# EAGLE design LlethrauControls (EAGLE 9.6.2)
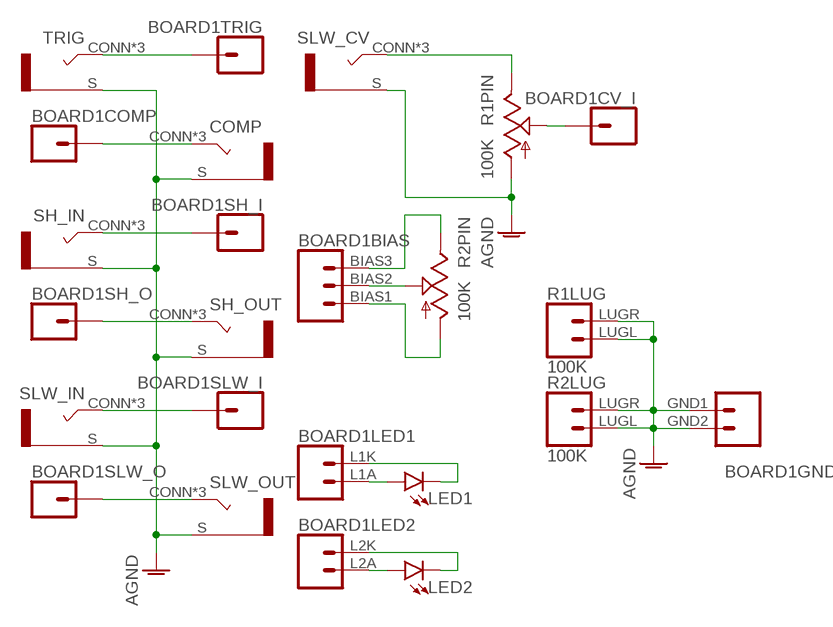
[diagram p0: schematic, sheet 1]

## Parts
BOARD1  LLETHRAU_LINK  [LLETHRAU]
COMP  COMBI-JACKCINCHNANA  [NEWCOMBOJACK_PANEL]
LED1  LED5MM  [LED5MM]
LED2  LED5MM  [LED5MM]
R1  100K  POTENTIOMETER  [ALPHA_RV09_9MMPOT]
R2  100K  POTENTIOMETER  [ALPHA_RV09_9MMPOT]
SH_IN  COMBI-JACKCINCHNANA  [NEWCOMBOJACK_PANEL]
SH_OUT  COMBI-JACKCINCHNANA  [NEWCOMBOJACK_PANEL]
SLW_CV  COMBI-JACKCINCHNANA  [NEWCOMBOJACK_PANEL]
SLW_IN  COMBI-JACKCINCHNANA  [NEWCOMBOJACK_PANEL]
SLW_OUT  COMBI-JACKCINCHNANA  [NEWCOMBOJACK_PANEL]
TRIG  COMBI-JACKCINCHNANA  [NEWCOMBOJACK_PANEL]

## Nets
AGND: BOARD1.GND1 BOARD1.GND2 COMP.S R1.C1(PIN:A) R1.LUGL R1.LUGR R2.LUGL R2.LUGR SH_IN.S SH_OUT.S SLW_CV.S SLW_IN.S SLW_OUT.S TRIG.S
N$1: BOARD1.TRIG TRIG.CONN(T) TRIG.T1(T) TRIG.T2(T)
N$2: BOARD1.COMP COMP.CONN(T) COMP.T1(T) COMP.T2(T)
N$3: BOARD1.SH_I SH_IN.CONN(T) SH_IN.T1(T) SH_IN.T2(T)
N$4: BOARD1.SH_O SH_OUT.CONN(T) SH_OUT.T1(T) SH_OUT.T2(T)
N$5: BOARD1.SLW_I SLW_IN.CONN(T) SLW_IN.T1(T) SLW_IN.T2(T)
N$6: BOARD1.SLW_O SLW_OUT.CONN(T) SLW_OUT.T1(T) SLW_OUT.T2(T)
N$7: BOARD1.BIAS1 R2.C1(PIN:A)
N$8: BOARD1.BIAS2 R2.C2(PIN:W)
N$9: BOARD1.BIAS3 R2.C3(PIN:B)
N$10: BOARD1.L2A LED2.A
N$11: R1.C3(PIN:B) SLW_CV.CONN(T) SLW_CV.T1(T) SLW_CV.T2(T)
N$12: BOARD1.CV_I R1.C2(PIN:W)
N$13: BOARD1.L2K LED2.K(C)
N$14: BOARD1.L1A LED1.A
N$15: BOARD1.L1K LED1.K(C)

## Library data of the parts
BOARD1 = ElectricNoodleBox:LLETHRAU_LINK
COMP SH_IN SH_OUT SLW_CV SLW_IN SLW_OUT TRIG = ElectricNoodleBox:COMBI-JACK
LED1 LED2 = led:LED: LED OSRAM: - CHIPLED LG R971, LG N971, LY N971, LG Q971, LY Q971, LO R971, LY R971 LH N974, LH R974 LS Q976, LO Q976, LY Q976 LO Q996 - Hyper CHIPLED LW Q18S LB Q993, LB Q99A, LB R99A - SideLED LS A670, LO A670, LY A670, LG A670, LP A670 LB A673, LV A673, LT A673, LW A673 LH A674 LY A675 LS A676, LA A676, LO A676, LY A676, LW A676 LS A679, LY A679, LG A679 - Hyper Micro SIDELED® LS Y876, LA Y876, LO Y876, LY Y876 LT Y87S - SmartLED LW L88C, LW L88S LB L89C, LB L89S, LG L890 LS L89K, LO L89K, LY L89K LS L896, LA L896, LO L896, LY L896 - TOPLED LS T670, LO T670, LY T670, LG T670, LP T670 LSG T670, LSP T670, LSY T670, LOP T670, LYG T670 LG T671, LOG T671, LSG T671 LB T673, LV T673, LT T673, LW T673 LH T674 LS T676, LA T676, LO T676, LY T676, LB T676, LH T676, LSB T676, LW T676 LB T67C, LV T67C, LT T67C, LS T67K, LO T67K, LY T67K, LW E67C LS E67B, LA E67B, LO E67B, LY E67B, LB E67C, LV E67C, LT E67C LW T67C LS T679, LY T679, LG T679 LS T770, LO T770, LY T770, LG T770, LP T770 LB T773, LV T773, LT T773, LW T773 LH T774 LS E675, LA E675, LY E675, LS T675 LS T776, LA T776, LO T776, LY T776, LB T776 LHGB T686 LT T68C, LB T68C - Hyper Mini TOPLED® LB M676 - Mini TOPLED Santana® LG M470 LS M47K, LO M47K, LY M47K Source: http://www.osram.convergy.de LUXEON: - LUMILED® LXK2-PW12-R00, LXK2-PW12-S00, LXK2-PW14-U00, LXK2-PW14-V00 LXK2-PM12-R00, LXK2-PM12-S00, LXK2-PM14-U00 LXK2-PE12-Q00, LXK2-PE12-R00, LXK2-PE12-S00, LXK2-PE14-T00, LXK2-PE14-U00 LXK2-PB12-K00, LXK2-PB12-L00, LXK2-PB12-M00, LXK2-PB14-N00, LXK2-PB14-P00, LXK2-PB14-Q00 LXK2-PR12-L00, LXK2-PR12-M00, LXK2-PR14-Q00, LXK2-PR14-R00 LXK2-PD12-Q00, LXK2-PD12-R00, LXK2-PD12-S00 LXK2-PH12-R00, LXK2-PH12-S00 LXK2-PL12-P00, LXK2-PL12-Q00, LXK2-PL12-R00 Source: www.luxeon.com KINGBRIGHT: KA-3528ASYC Source: www.kingbright.com
R1 R2 = ElectricNoodleBox:POTENTIOMETER

## Board
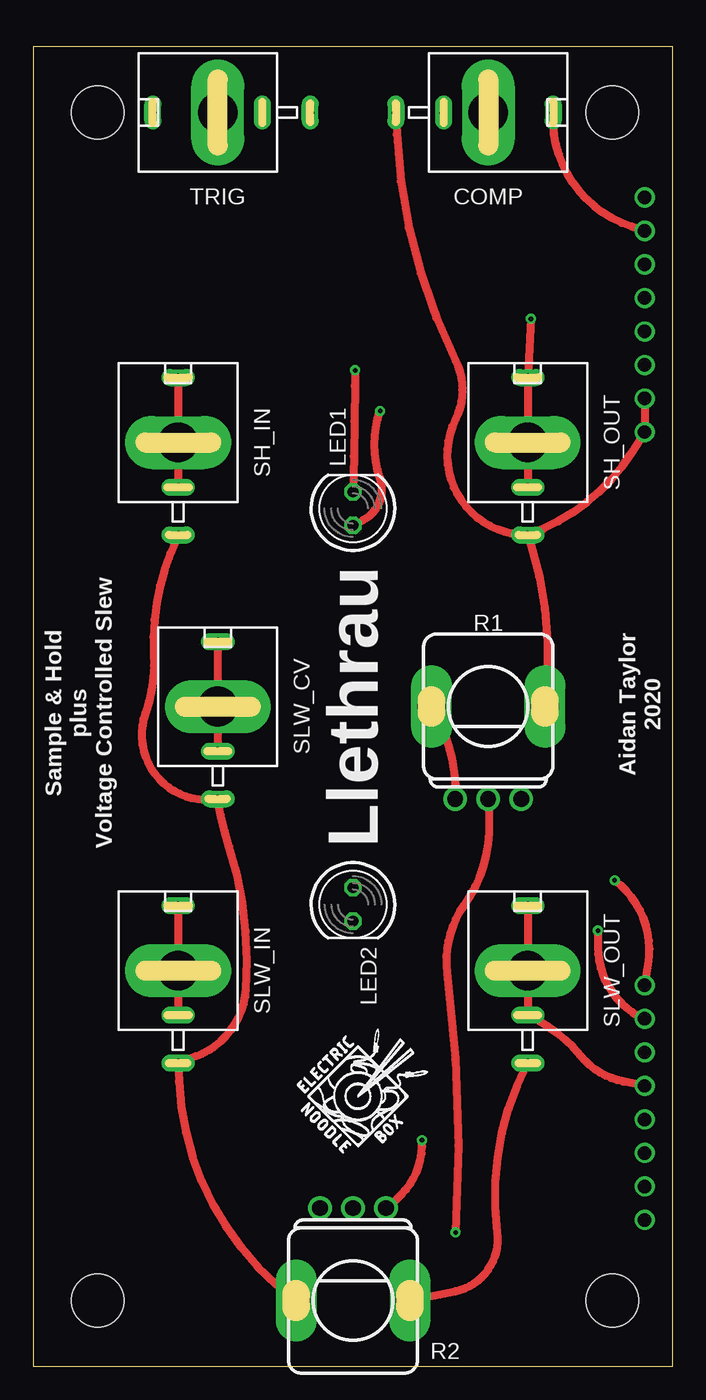
[diagram p1: board, top side]
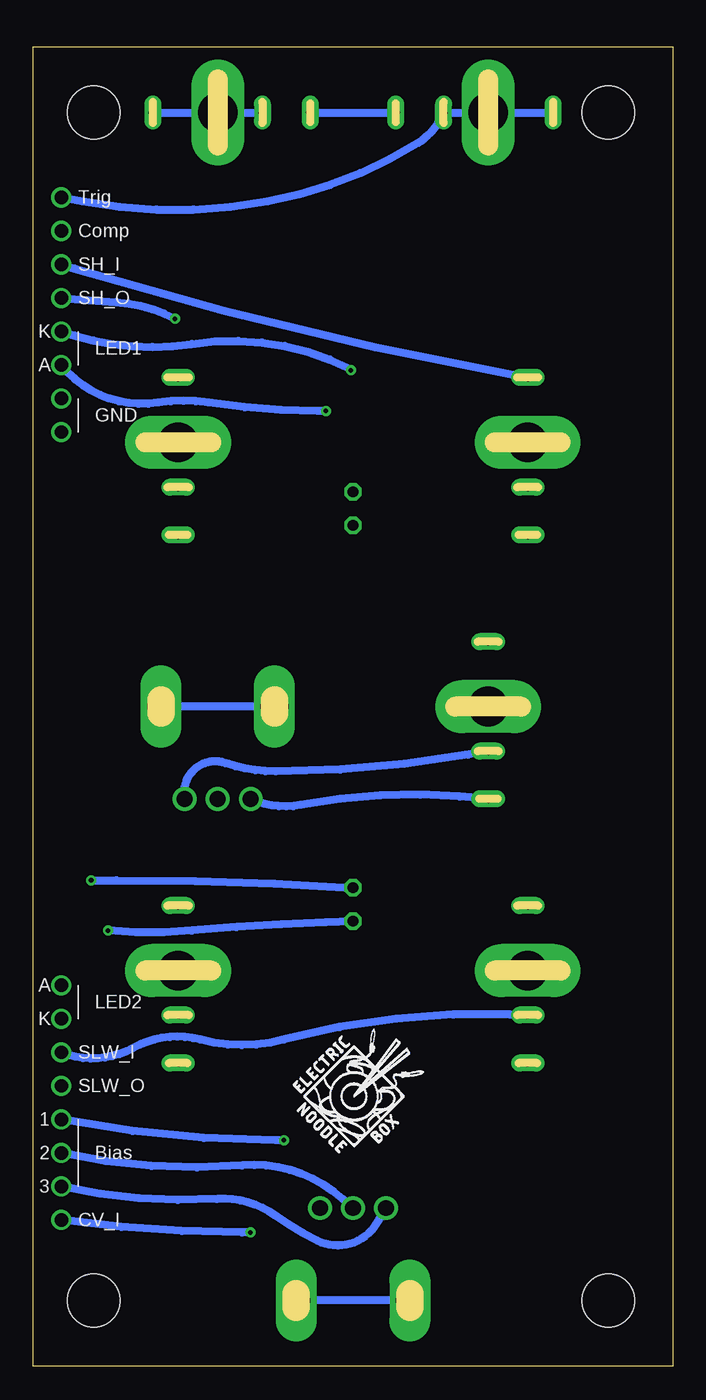
[diagram p2: board, bottom side, seen from below]

Size 48.5 x 100 mm. Coordinates in mm from the lower left corner, seen from the top.
Outline: 0,0 48.5,0 48.5,100 0,100 0,0
Copper layers (1*16): Top 0.035mm / dielectric 1.5mm / Bottom 0.035mm
Design rules "default": minimum track width 6mil, minimum drill 0.35mm, track to track 6mil, track to pad 6mil, pad to pad 6mil, via to via 6mil, smd to smd 6mil, copper to edge 40mil, drill to drill 6mil, minimum pad ring 10mil, minimum via ring 8mil, stop-mask expansion 4mil, vias tented up to drill 0mil, thermal gap 10mil

### Footprints (pad centres in the part's own frame; a part is rotated, then mirrored left to right if it is on the bottom)
LLETHRAU = drill 1.016: BIAS1 81.28,2.54; BIAS2 83.82,2.54; BIAS3 86.36,2.54; COMP 13.97,2.54; CV_I 88.9,2.54; GND1 26.67,2.54; GND2 29.21,2.54; L1A 24.13,2.54; L1K 21.59,2.54; L2A 71.12,2.54; L2K 73.66,2.54; SH_I 16.51,2.54; SH_O 19.05,2.54; SLW_I 76.2,2.54; SLW_O 78.74,2.54; TRIG 11.43,2.54 | hole 4: 5,5; 95,5; 95,44; 5,44
NEWCOMBOJACK_PANEL = drill 3 pad 3.6 long: CONN 0,0 | drill 0.6 pad 1.27 long: S 0,-7; T1 0,4.92; T2 0,-3.38
LED5MM = drill 0.813 octagon: A -1.27,0; K 1.27,0
ALPHA_RV09_9MMPOT = drill 1.2 pad 1.778: C1 -2.5,-7; C2 0,-7; C3 2.5,-7 | drill 2.1 pad 2.8 long: LUGL -4.3,0; LUGR 4.3,0

### Placement (x,y rotation side)
BOARD1  48.9,100 270 bottom
COMP  34.5,95 270 top
LED1  24.25,65 90 top
LED2  24.25,35 270 top
R1  34.5,50 0 top
R2  24.25,5 180 top
SH_IN  11,70 0 top
SH_OUT  37.5,70 0 top
SLW_CV  14,50 0 top
SLW_IN  11,30 0 top
SLW_OUT  37.5,30 0 top
TRIG  14,95 90 top
U$1  [LOGO10X10]  19.95,15.88 0 top
U$2  [LOGO10X10]  28.84,15.88 0 bottom

### Tracks (layer width: path | path; a pad name or v marks a point on that pad's centre or on a via)
AGND
  Top 0.61: BOARD1.GND1 BOARD1.GND2 45.35,69.22 arc-38 SH_OUT.S | SH_OUT.S 37.73,62.23 arc-24 R1.LUGR | SH_IN.S 10.43,61.59 arc25 9.16,53.98 arc-23 8.53,49.53 arc119 SLW_CV.S arc8 14.88,39.37 arc-22 16.14,28.57 arc-66 12.34,23.5 SLW_IN.S 11.06,21.59 arc51 R2.LUGR | R1.LUGL 30.75,48.9 arc-29 R1.C1 | R2.LUGL 32.02,5.71 arc86 35.2,10.16 arc-35 SLW_OUT.S | COMP.S 27.57,93.34 arc24 32.02,76.2 arc-53 32.02,71.75 arc117 SH_OUT.S
  Bottom 0.61: COMP.S TRIG.S | R1.LUGL R1.LUGR | SLW_CV.S 16.14,43.18 arc-16 28.21,42.55 arc35 R1.C1 | R2.LUGR R2.LUGL
N$1
  Bottom 0.61: BOARD1.TRIG 44.72,88.27 arc-21 30.75,88.27 arc-21 19.32,92.71 arc-36 TRIG.T2 TRIG.CONN TRIG.T1
N$2
  Top 0.61: BOARD1.COMP 45.35,86.36 arc-75 COMP.T1
  Bottom 0.61: COMP.T1 COMP.CONN COMP.T2
N$3
  Top 0.61: SH_IN.T1 SH_IN.CONN SH_IN.T2
  Bottom 0.61: BOARD1.SH_I 45.35,83.19 arc-7 SH_IN.T1
N$4  (via drill 0.35)
  Top 0.61: v37.73,79.38 SH_OUT.T1 SH_OUT.CONN SH_OUT.T2
  Bottom 0.61: BOARD1.SH_O 42.18,80.64 arc24 v37.73,79.38
N$5
  Top 0.61: SLW_IN.T1 SLW_IN.CONN SLW_IN.T2
  Bottom 0.61: SLW_IN.T2 12.34,26.67 arc-17 29.48,24.77 arc30 35.83,24.77 arc-44 40.91,24.13 arc51 BOARD1.SLW_I
N$6
  Top 0.61: BOARD1.SLW_O 44.72,21.59 arc-39 41.55,23.5 arc26 SLW_OUT.T2 SLW_OUT.CONN SLW_OUT.T1
N$7  (via drill 0.35)
  Top 0.61: R2.C1 27.57,12.7 arc53 v29.48,17.14
  Bottom 0.61: v29.48,17.14 30.11,17.14 arc11 BOARD1.BIAS1
N$8
  Bottom 0.61: R2.C2 25.04,12.7 arc-47 32.66,15.24 arc18 BOARD1.BIAS2
N$9
  Bottom 0.61: R2.C3 22.5,10.79 arc85 26.94,9.53 arc9 30.11,11.43 arc-39 34.56,12.7 arc16 BOARD1.BIAS3
N$10  (via drill 0.35)
  Top 0.61: BOARD1.L2A 46.62,30.48 arc63 v44.09,36.83
  Bottom 0.61: v44.09,36.83 42.18,36.83 arc4 LED2.A
N$11
  Top 0.61: SLW_CV.T1 SLW_CV.CONN SLW_CV.T2
  Bottom 0.61: SLW_CV.T2 15.51,46.35 arc10 30.11,45.09 arc19 33.92,45.72 arc-121 R1.C3
N$12  (via drill 0.35)
  Top 0.61: R1.C2 34.56,41.27 arc-37 32.66,34.92 arc43 31.38,29.84 arc-11 v32.02,10.16
  Bottom 0.61: v32.02,10.16 32.66,10.16 arc8 BOARD1.CV_I
N$13  (via drill 0.35)
  Top 0.61: v42.81,33.02 42.81,31.75 arc66 BOARD1.L2K
  Bottom 0.61: LED2.K 26.3,33.66 arc-3 36.47,33.02 arc10 v42.81,33.02
N$14  (via drill 0.35)
  Top 0.61: LED1.A 25.04,64.14 arc82 26.3,67.31 arc-38 v26.3,72.39
  Bottom 0.61: v26.3,72.39 26.94,72.39 arc9 35.2,73.03 arc-18 39.01,73.03 arc60 BOARD1.L1A
N$15  (via drill 0.35)
  Top 0.61: v24.41,75.47 24.4,74.3 arc-1 LED1.K
  Bottom 0.61: BOARD1.L1K 45.35,78.11 arc-26 36.47,77.47 arc36 24.4,75.56 arc144 v24.41,75.47

### Text on the board
tPlace: Sample & Hold / plus / Voltage Controlled Slew | Llethrau | Aidan Taylor / 2020